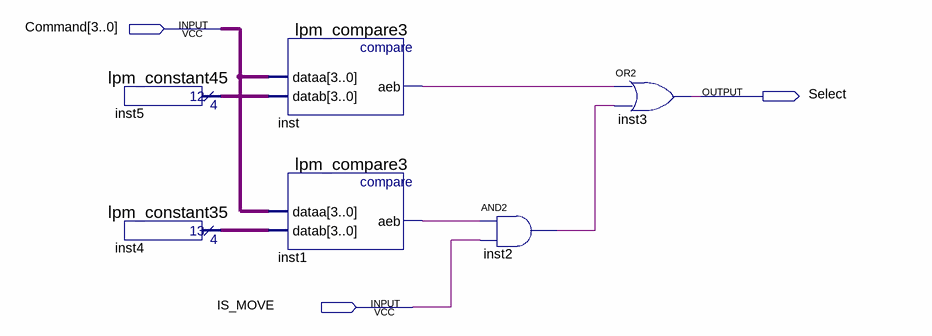
[diagram p0: schematic sheet]
// Quartus schematic SelectIP.bdf as structural Verilog: 6 symbols, 3 pins
module SelectIP (
  input  [3:0] Command,
  input  IS_MOVE,
  output Select
);

  wire inst1_aeb, inst2_out, inst_aeb;
  wire [3:0] inst4_result, inst5_result;

  lpm_constant45 inst5 (.result(inst5_result));
  lpm_constant35 inst4 (.result(inst4_result));
  lpm_compare3 inst (.dataa(Command), .datab(inst5_result), .aeb(inst_aeb));
  lpm_compare3 inst1 (.dataa(Command), .datab(inst4_result), .aeb(inst1_aeb));
  and inst2 (inst2_out, inst1_aeb, IS_MOVE);
  or inst3 (Select, inst_aeb, inst2_out);
endmodule
